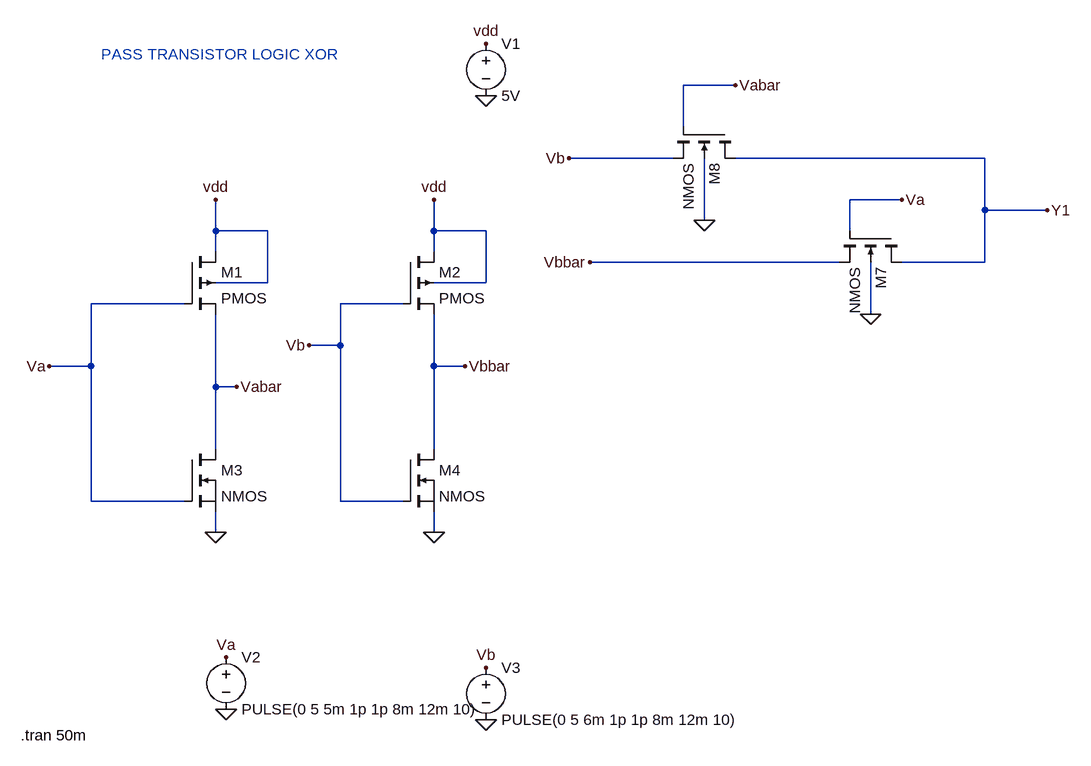
[diagram p0: schematic PASS TRANSISTOR LOGIC XOR.asc]
PASS TRANSISTOR LOGIC XOR.asc, the LTspice schematic file:
Version 4
SHEET 1 1052 808
WIRE 480 -208 400 -208
WIRE 400 -144 400 -208
WIRE 384 -96 224 -96
WIRE 864 -96 480 -96
WIRE 736 -32 656 -32
WIRE 864 -16 864 -96
WIRE 960 -16 864 -16
WIRE 432 0 432 -96
WIRE -320 16 -320 -32
WIRE -240 16 -320 16
WIRE 16 16 16 -32
WIRE 96 16 16 16
WIRE 656 16 656 -32
WIRE -320 48 -320 16
WIRE 16 48 16 16
WIRE 640 64 256 64
WIRE 864 64 864 -16
WIRE 864 64 736 64
WIRE -240 96 -240 16
WIRE -240 96 -320 96
WIRE 96 96 96 16
WIRE 96 96 16 96
WIRE -368 128 -512 128
WIRE -32 128 -128 128
WIRE 688 144 688 64
WIRE -128 192 -128 128
WIRE -128 192 -176 192
WIRE -512 224 -512 128
WIRE -512 224 -576 224
WIRE 16 224 16 144
WIRE 64 224 16 224
WIRE -320 256 -320 144
WIRE -288 256 -320 256
WIRE -320 352 -320 256
WIRE 16 352 16 224
WIRE -512 432 -512 224
WIRE -368 432 -512 432
WIRE -128 432 -128 192
WIRE -32 432 -128 432
WIRE -320 480 -320 448
WIRE 16 480 16 448
FLAG -320 480 0
FLAG 16 480 0
FLAG 688 144 0
FLAG 432 0 0
FLAG -320 -32 vdd
FLAG 16 -32 vdd
FLAG -576 224 Va
FLAG -288 256 Vabar
FLAG -176 192 Vb
FLAG 64 224 Vbbar
FLAG 224 -96 Vb
FLAG 480 -208 Vabar
FLAG 736 -32 Va
FLAG 256 64 Vbbar
FLAG 960 -16 Y1
FLAG 96 -192 0
FLAG 96 -272 vdd
FLAG -304 672 Va
FLAG 96 688 Vb
FLAG -304 752 0
FLAG 96 768 0
SYMBOL pmos4 -368 48 R0
SYMATTR InstName M1
SYMBOL pmos4 -32 48 R0
SYMATTR InstName M2
SYMBOL nmos -368 352 R0
SYMATTR InstName M3
SYMBOL nmos -32 352 R0
SYMATTR InstName M4
SYMBOL nmos4 736 16 R90
SYMATTR InstName M7
SYMBOL nmos4 480 -144 R90
SYMATTR InstName M8
SYMBOL voltage 96 -288 R0
SYMATTR InstName V1
SYMATTR Value 5V
SYMBOL voltage -304 656 R0
WINDOW 123 0 0 Left 0
WINDOW 39 0 0 Left 0
SYMATTR InstName V2
SYMATTR Value PULSE(0 5 5m 1p 1p 8m 12m 10)
SYMBOL voltage 96 672 R0
SYMATTR InstName V3
SYMATTR Value PULSE(0 5 6m 1p 1p 8m 12m 10)
TEXT -620 792 Left 2 !.tran 50m
TEXT -496 -256 Left 2 ;PASS TRANSISTOR LOGIC XOR

The netlist it stands for:
* PASS TRANSISTOR LOGIC XOR.asc
M1 vdd Va Vabar vdd PMOS
M2 vdd Vb Vbbar vdd PMOS
M3 Vabar Va 0 0 NMOS
M4 Vbbar Vb 0 0 NMOS
M7 Y1 Va Vbbar 0 NMOS
M8 Y1 Vabar Vb 0 NMOS
V1 vdd 0 5V
V2 Va 0 PULSE(0 5 5m 1p 1p 8m 12m 10)
V3 Vb 0 PULSE(0 5 6m 1p 1p 8m 12m 10)
.model NMOS NMOS
.model PMOS PMOS
.lib standard.mos
.tran 50m
* PASS TRANSISTOR LOGIC XOR
.backanno
.end